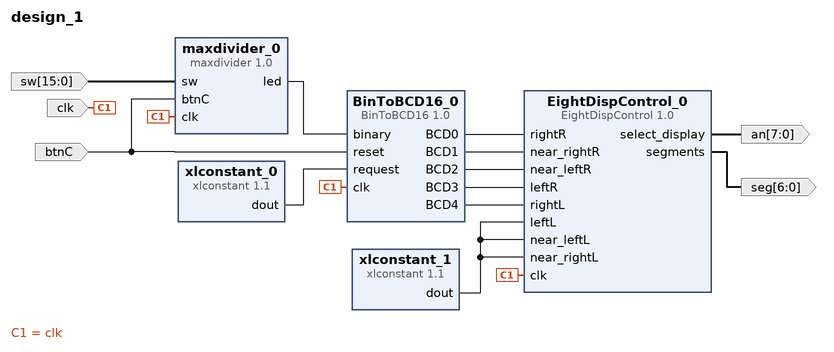
[diagram p0: block diagram of the top level]
# Vivado block design design_1, xc7a100tcsg324-1, Vivado 2016.4
create_bd_design design_1

create_bd_port -dir I clk
create_bd_port -dir I btnC
create_bd_port -dir O -from 7 -to 0 an
create_bd_port -dir O -from 6 -to 0 seg
create_bd_port -dir I -from 15 -to 0 sw

create_bd_cell -type ip -vlnv ua.pt:user:BinToBCD16:1.0 BinToBCD16_0
set_property -dict {CONFIG.size_of_data_to_convert 8} [get_bd_cells BinToBCD16_0]
create_bd_cell -type ip -vlnv xilinx.com:ip:xlconstant:1.1 xlconstant_0
create_bd_cell -type ip -vlnv ua.pt:user:EightDispControl:1.0 EightDispControl_0
create_bd_cell -type ip -vlnv xilinx.com:ip:xlconstant:1.1 xlconstant_1
set_property -dict {CONFIG.CONST_WIDTH 4} [get_bd_cells xlconstant_1]
create_bd_cell -type ip -vlnv xilinx.com:user:maxdivider:1.0 maxdivider_0

# ---- connections ----

connect_bd_net [get_bd_ports clk] [get_bd_pins BinToBCD16_0/clk] [get_bd_pins EightDispControl_0/clk] [get_bd_pins maxdivider_0/clk]
connect_bd_net [get_bd_ports btnC] [get_bd_pins BinToBCD16_0/reset] [get_bd_pins maxdivider_0/btnC]
connect_bd_net [get_bd_pins xlconstant_0/dout] [get_bd_pins BinToBCD16_0/request]
connect_bd_net [get_bd_pins BinToBCD16_0/BCD0] [get_bd_pins EightDispControl_0/rightR]
connect_bd_net [get_bd_pins BinToBCD16_0/BCD1] [get_bd_pins EightDispControl_0/near_rightR]
connect_bd_net [get_bd_pins BinToBCD16_0/BCD2] [get_bd_pins EightDispControl_0/near_leftR]
connect_bd_net [get_bd_pins BinToBCD16_0/BCD3] [get_bd_pins EightDispControl_0/leftR]
connect_bd_net [get_bd_pins BinToBCD16_0/BCD4] [get_bd_pins EightDispControl_0/rightL]
connect_bd_net [get_bd_pins xlconstant_1/dout] \
  [get_bd_pins EightDispControl_0/leftL] [get_bd_pins EightDispControl_0/near_leftL] \
  [get_bd_pins EightDispControl_0/near_rightL]
connect_bd_net [get_bd_pins EightDispControl_0/select_display] [get_bd_ports an]
connect_bd_net [get_bd_pins EightDispControl_0/segments] [get_bd_ports seg]
connect_bd_net [get_bd_ports sw] [get_bd_pins maxdivider_0/sw]
connect_bd_net [get_bd_pins maxdivider_0/led] [get_bd_pins BinToBCD16_0/binary]

validate_bd_design
save_bd_design
